# EAGLE design main (EAGLE 5.11)
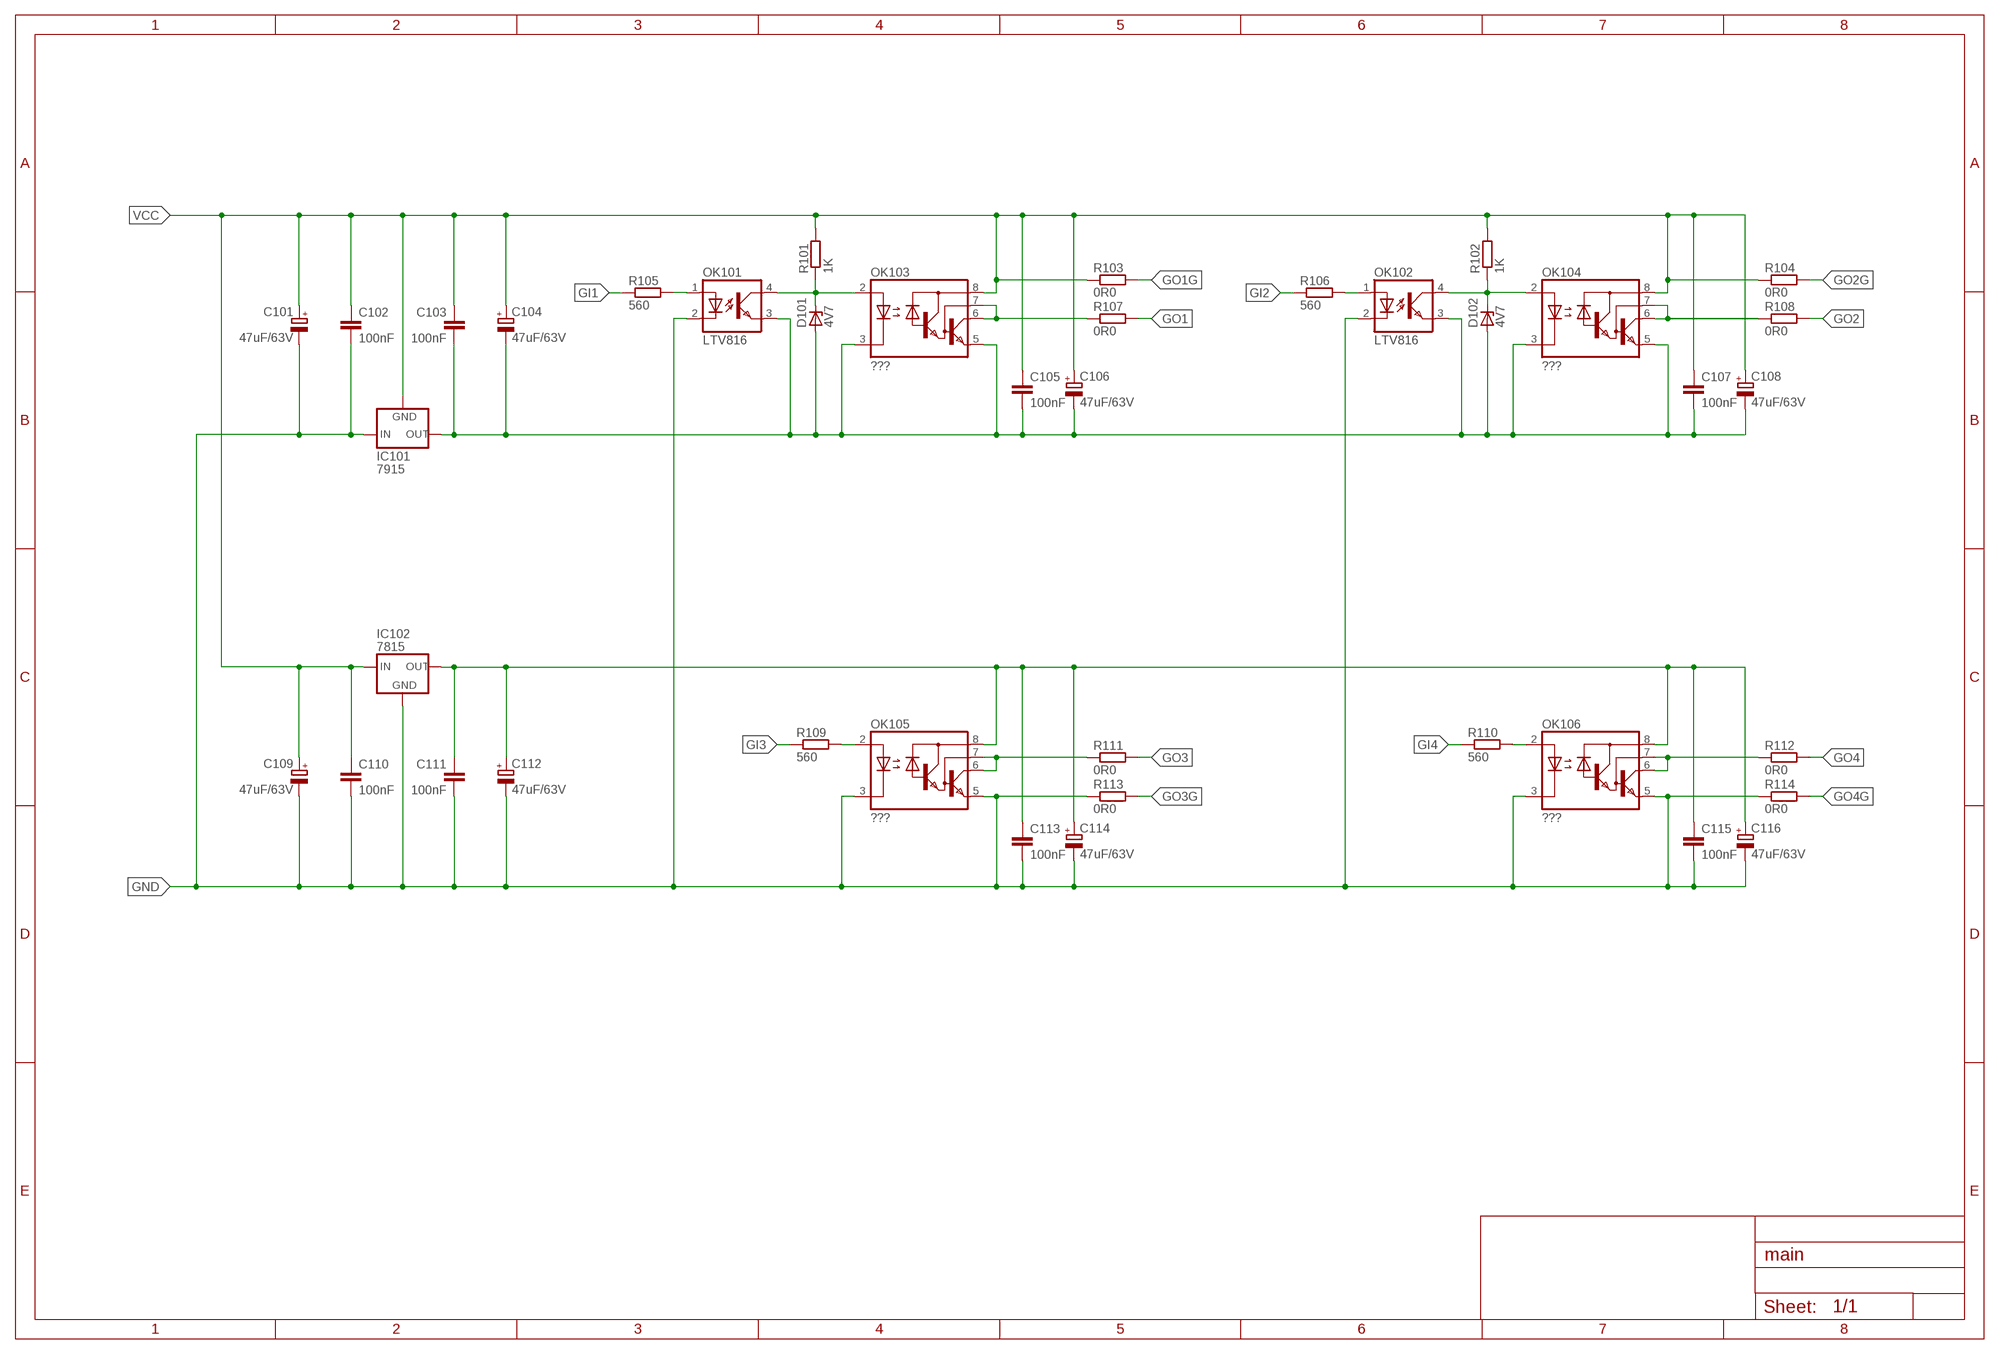
[diagram p0: schematic, sheet 1]

## Parts
C101  47uF/63V  CPOL-EUE2.5-5  [E2,5-5]
C102  100nF  C-EU050-025X075  [C050-025X075]
C103  100nF  C-EU050-025X075  [C050-025X075]
C104  47uF/63V  CPOL-EUE2.5-5  [E2,5-5]
C105  100nF  C-EU050-025X075  [C050-025X075]
C106  47uF/63V  CPOL-EUE2.5-5  [E2,5-5]
C107  100nF  C-EU050-025X075  [C050-025X075]
C108  47uF/63V  CPOL-EUE2.5-5  [E2,5-5]
C109  47uF/63V  CPOL-EUE2.5-5  [E2,5-5]
C110  100nF  C-EU050-025X075  [C050-025X075]
C111  100nF  C-EU050-025X075  [C050-025X075]
C112  47uF/63V  CPOL-EUE2.5-5  [E2,5-5]
C113  100nF  C-EU050-025X075  [C050-025X075]
C114  47uF/63V  CPOL-EUE2.5-5  [E2,5-5]
C115  100nF  C-EU050-025X075  [C050-025X075]
C116  47uF/63V  CPOL-EUE2.5-5  [E2,5-5]
D101  4V7  ZENER-DIODEZD-2.5  [ZDIO-2.5]
D102  4V7  ZENER-DIODEZD-2.5  [ZDIO-2.5]
IC101  7915  79XXS  [79XXS]
IC102  7815  78XXS  [78XXS]
OK101  LTV816  [DIL04]
OK102  LTV816  [DIL04]
OK103  ???  6N138  [DIL08]
OK104  ???  6N138  [DIL08]
OK105  ???  6N138  [DIL08]
OK106  ???  6N138  [DIL08]
R101  1K  R-EU_0207/7  [0207/7]
R102  1K  R-EU_0207/7  [0207/7]
R103  0R0  R-EU_0207/7  [0207/7]
R104  0R0  R-EU_0207/7  [0207/7]
R105  560  R-EU_0207/7  [0207/7]
R106  560  R-EU_0207/7  [0207/7]
R107  0R0  R-EU_0207/7  [0207/7]
R108  0R0  R-EU_0207/7  [0207/7]
R109  560  R-EU_0207/7  [0207/7]
R110  560  R-EU_0207/7  [0207/7]
R111  0R0  R-EU_0207/7  [0207/7]
R112  0R0  R-EU_0207/7  [0207/7]
R113  0R0  R-EU_0207/7  [0207/7]
R114  0R0  R-EU_0207/7  [0207/7]

## Nets
GI1: R105.1
GI2: R106.1
GI3: R109.1
GI4: R110.1
GND: C101.- C102.2 C109.- C110.2 C111.2 C112.- C113.2 C114.- C115.2 C116.- IC101.IN IC102.GND OK101.2(C) OK102.2(C) OK105.3(C) OK105.5(GND) OK106.3(C) OK106.5(GND) R113.1 R114.1
GO1: R107.2
GO1G: R103.2
GO2: R108.2
GO2G: R104.2
GO3: R111.2
GO3G: R113.2
GO4: R112.2
GO4G: R114.2
N$1: OK105.6(VO) OK105.7(VB) R111.1
N$2: OK105.2(A) R109.2
N$4: C111.1 C112.+ C113.1 C114.+ C115.1 C116.+ IC102.OUT OK105.8(VCC) OK106.8(VCC)
N$5: D101.C OK101.4(COL) OK103.2(A) R101.1
N$6: C103.2 C104.- C105.2 C106.- C107.2 C108.- D101.A D102.A IC101.OUT OK101.3(EMIT) OK102.3(EMIT) OK103.3(C) OK103.5(GND) OK104.3(C) OK104.5(GND)
N$8: OK104.6(VO) OK104.7(VB) R108.1
N$10: OK106.2(A) R110.2
N$11: OK101.1(A) R105.2
N$12: OK102.1(A) R106.2
N$13: OK106.6(VO) OK106.7(VB) R112.1
N$15: D102.C OK102.4(COL) OK104.2(A) R102.1
N$17: OK103.6(VO) OK103.7(VB) R107.1
VCC: C101.+ C102.1 C103.1 C104.+ C105.1 C106.+ C107.1 C108.+ C109.+ C110.1 IC101.GND IC102.IN OK103.8(VCC) OK104.8(VCC) R101.2 R102.2 R103.1 R104.1

## Library data of the parts
C101 C104 C106 C108 C109 C112 C114 C116 = rcl:CPOL-EU: POLARIZED CAPACITOR, European symbol
C102 C103 C105 C107 C110 C111 C113 C115 = rcl:C-EU: CAPACITOR, European symbol
D101 D102 = diode:ZENER-DIODE: Z-Diode
IC101 = v-reg:79XXS: VOLTAGE REGULATOR
IC102 = v-reg:78XXS: VOLTAGE REGULATOR
OK101 OK102 = optocoupler:LTV816: OPTO COUPLER Source: LITEON, LTV816.pdf; OC_FARNELL: unknown; OC_NEWARK: unknown
OK103-OK106 = optocoupler:6N138: MOTOROLA OPTO COUPLER; MF: VISHAY/TELEFUNKEN; MPN: 6N138; OC_FARNELL: 9860150; OC_NEWARK: 35K5294
R101-R114 = rcl:R-EU_: RESISTOR, European symbol

## Board
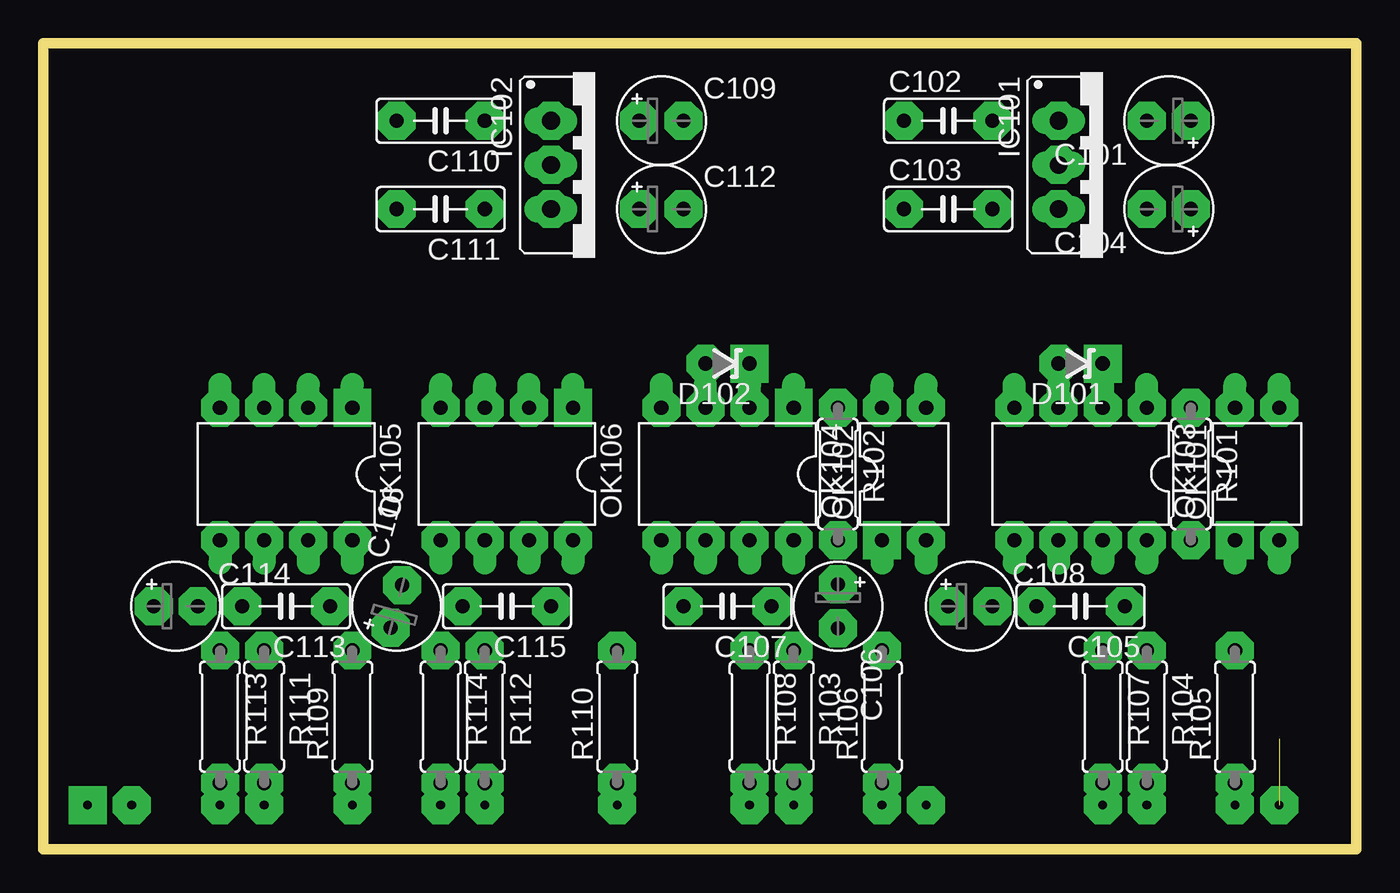
[diagram p1: board, top side]
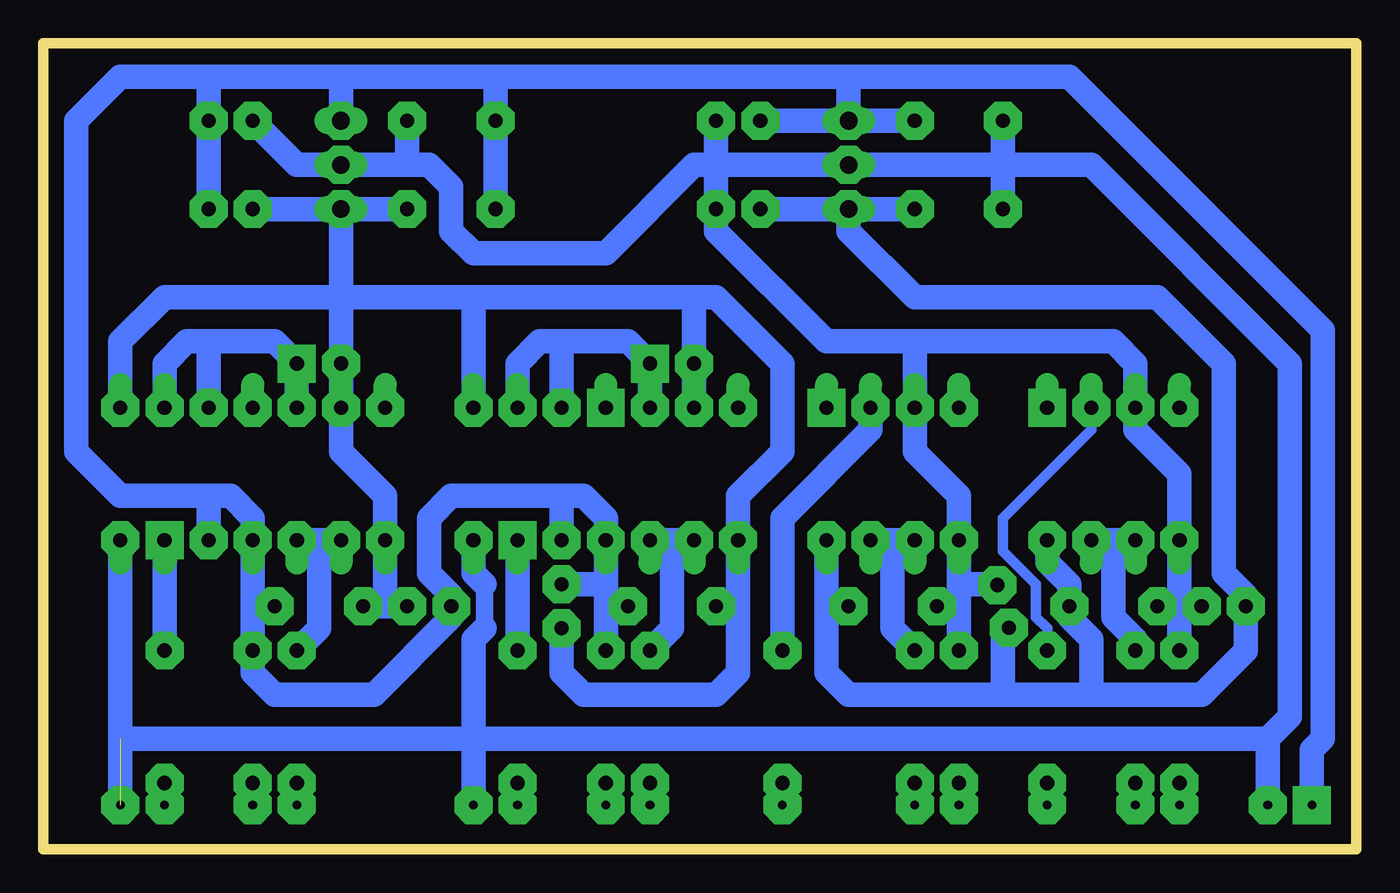
[diagram p2: board, bottom side, seen from below]

Size 75.55 x 46.35 mm. Coordinates in mm from the lower left corner, seen from the top.
Outline: 0,0 75.55,0 75.55,46.35 0,46.35 0,0
Copper layers (1*16): Top 0.035mm / dielectric 1.5mm / Bottom 0.035mm
Design rules "default": minimum track width 10mil, minimum drill 24mil, track to track 8mil, track to pad 8mil, pad to pad 8mil, via to via 8mil, smd to smd 8mil, copper to edge 40mil, drill to drill 8mil, minimum pad ring 10mil, minimum via ring 8mil, stop-mask expansion 4mil, vias tented up to drill 0mil, thermal gap 10mil

### Footprints (pad centres in the part's own frame; a part is rotated, then mirrored left to right if it is on the bottom)
E2,5-5 = drill 0.813 pad 1.6 round: + -1.27,0 | drill 0.813 pad 1.6 octagon: - 1.27,0
C050-025X075 = drill 0.813 octagon: 1 -2.54,0; 2 2.54,0
ZDIO-2.5 = drill 0.813 octagon: A 1.27,0; C -1.27,0
79XXS = drill 1.016 long: GND -2.54,-2.54; IN 0,-2.54; OUT 2.54,-2.54
78XXS = drill 1.016 long: GND 0,-2.54; IN -2.54,-2.54; OUT 2.54,-2.54
DIL04 = drill 0.813 offset: 1 -1.27,-3.81; 2 1.27,-3.81; 3 1.27,3.81; 4 -1.27,3.81
DIL08 = drill 0.813 offset: 1 -3.81,-3.81; 2 -1.27,-3.81; 3 1.27,-3.81; 4 3.81,-3.81; 5 3.81,3.81; 6 1.27,3.81; 7 -1.27,3.81; 8 -3.81,3.81
0207/7 = drill 0.813 octagon: 1 -3.81,0; 2 3.81,0

### Placement (x,y rotation side)
C101  64.77,41.91 180 top
C102  52.07,41.91 0 top
C103  52.07,36.83 0 top
C104  64.77,36.83 180 top
C105  59.69,13.97 180 top
C106  45.72,13.97 270 top
C107  39.37,13.97 180 top
C108  53.34,13.97 0 top
C109  35.56,41.91 0 top
C110  22.86,41.91 180 top
C111  22.86,36.83 180 top
C112  35.56,36.83 0 top
C113  13.97,13.97 180 top
C114  7.62,13.97 0 top
C115  26.67,13.97 180 top
C116  20.32,13.97 75 top
D101  59.69,27.94 180 top
D102  39.37,27.94 180 top
IC101  60.96,39.37 270 top
IC102  31.75,39.37 270 top
OK101  69.85,21.59 0 top
OK102  49.53,21.59 0 top
OK103  59.69,21.59 180 top
OK104  39.37,21.59 180 top
OK105  13.97,21.59 180 top
OK106  26.67,21.59 180 top
R101  66.04,21.59 270 top
R102  45.72,21.59 270 top
R103  43.18,7.62 270 top
R104  63.5,7.62 270 top
R105  68.58,7.62 90 top
R106  48.26,7.62 90 top
R107  60.96,7.62 270 top
R108  40.64,7.62 270 top
R109  17.78,7.62 90 top
R110  33.02,7.62 90 top
R111  12.7,7.62 270 top
R112  25.4,7.62 270 top
R113  10.16,7.62 270 top
R114  22.86,7.62 270 top

### Tracks (layer width: path | path; a pad name or v marks a point on that pad's centre or on a via)
GI1  (via drill 0.5 pad 2.18)
  Bottom 1.422: R105.1 v68.58,2.54
  other vias: 68.58,3.81
GI2  (via drill 0.5 pad 2.18)
  Bottom 1.422: R106.1 v48.26,2.54
  other vias: 48.26,3.81
GI3  (via drill 0.5 pad 2.18)
  Bottom 1.422: R109.1 v17.78,2.54
  other vias: 17.78,3.81
GI4  (via drill 0.5 pad 2.18)
  Bottom 1.422: R110.1 v33.02,2.54
  other vias: 33.02,3.81
GND  (via drill 0.5 pad 2.18)  (1 unrouted)
  Bottom 0.61: 10.16,13.97 C114.-
  Bottom 1.016: 50.16,12.7 50.16,15.24
  Bottom 1.422: C101.- 60.96,39.37 IC101.IN 54.61,39.37 | 36.83,39.37 C112.- 36.83,35.56 30.48,29.21 25.4,29.21 | 36.83,39.37 IC102.GND 20.32,39.37 | 20.32,39.37 C110.2 | 20.32,39.37 C111.2 | 36.83,39.37 C109.- | 36.83,39.37 38.1,39.37 43.18,34.29 50.8,34.29 52.07,35.56 52.07,38.1 53.34,39.37 54.61,39.37 | 22.86,15.24 OK106.5 22.86,20.32 25.4,22.86 OK106.3 25.4,29.21 | 22.86,15.24 22.86,13.97 | 22.86,13.97 C115.2 | 10.16,13.97 OK105.5 10.16,21.59 12.7,24.13 OK105.3 12.7,27.94 13.97,29.21 25.4,29.21 | 50.8,6.35 71.12,6.35 | 10.16,13.97 C113.2 | 10.16,13.97 R113.1 | 22.86,13.97 R114.1 | 54.61,39.37 C102.2 | 50.8,6.35 50.8,12.06 50.16,12.7 | 50.16,15.24 50.8,15.88 OK102.2 | 5.08,6.35 50.8,6.35 | 5.08,6.35 3.81,7.62 3.81,27.94 15.24,39.37 20.32,39.37 | v5.08,2.54 5.08,6.35 | v71.12,2.54 OK101.2 | 50.8,6.35 v50.8,2.54 | 22.86,15.24 20.95,15.24 C116.-
  other vias: 10.16,17.78 22.86,17.78 50.8,17.78 71.12,17.78 25.4,25.4 12.7,25.4 24.13,13.97 11.43,13.97 10.16,11.43 22.86,11.43 20.32,36.83 20.32,41.91 29.21,39.37 36.83,36.83 36.83,41.91 58.42,39.37 63.5,41.91 54.61,41.91 20.65,15.2 8.89,13.97
GO1  (via drill 0.5 pad 2.18)
  Bottom 1.422: R107.2 v60.96,2.54
  other vias: 60.96,3.81
GO1G  (via drill 0.5 pad 2.18)
  Bottom 1.422: R103.2 v43.18,2.54
  other vias: 43.18,3.81
GO2  (via drill 0.5 pad 2.18)
  Bottom 1.422: R108.2 v40.64,2.54
  other vias: 40.64,3.81
GO2G  (via drill 0.5 pad 2.18)
  Bottom 1.422: R104.2 v63.5,2.54
  other vias: 63.5,3.81
GO3  (via drill 0.5 pad 2.18)
  Bottom 1.422: R111.2 v12.7,2.54
  other vias: 12.7,3.81
GO3G  (via drill 0.5 pad 2.18)
  Bottom 1.422: R113.2 v10.16,2.54
  other vias: 10.16,3.81
GO4  (via drill 0.5 pad 2.18)
  Bottom 1.422: R112.2 v25.4,2.54
  other vias: 25.4,3.81
GO4G  (via drill 0.5 pad 2.18)
  Bottom 1.422: R114.2 v22.86,2.54
  other vias: 22.86,3.81
N$1  (via drill 0.5 pad 2.18)
  Bottom 1.422: 13.97,17.78 OK105.7 | 13.97,17.78 OK105.6 | R111.1 12.7,12.06 13.97,13.34 13.97,17.78
  other vias: 12.7,17.78 15.24,17.78 12.7,11.43
N$2  (via drill 0.5 pad 2.18)
  Bottom 0.61: R109.2 17.78,12.7 18.41,13.34 18.41,15.24 20.32,17.14 20.32,19.05 15.24,24.13 OK105.2
  other vias: 15.24,25.4 17.78,11.43
N$4  (via drill 0.5 pad 2.18)
  Bottom 0.61: C116.+ 19.99,11.76 20.32,11.43
  Bottom 1.422: IC102.OUT C112.+ | IC102.OUT C111.1 | 30.48,13.97 OK106.8 | 30.48,13.97 30.48,10.16 29.21,8.89 20.32,8.89 | 30.48,13.97 C115.1 | 15.24,8.89 8.89,8.89 6.35,11.43 C114.+ 6.35,14.61 7.62,15.88 7.62,27.94 11.43,31.75 25.4,31.75 29.21,35.56 IC102.OUT | 15.24,8.89 20.32,8.89 | 20.32,8.89 20.32,11.43 20.32,12.41 C116.+ | OK105.8 17.78,16.51 16.51,15.24 C113.1 16.51,13.34 15.24,12.06 15.24,8.89
  other vias: 17.78,17.78 30.48,17.78 29.21,13.97 16.51,13.97 25.4,36.83 29.21,36.83 34.29,36.83 19.99,12.74 6.35,13.97
N$5  (via drill 0.5 pad 2.18)
  Bottom 1.422: OK103.2 D101.C 62.23,29.21 66.04,29.21 | 66.04,29.21 67.31,29.21 68.58,27.94 OK101.4 | 66.04,29.21 R101.1
  other vias: 68.58,25.4 66.04,25.4 60.96,25.4 60.96,27.94
N$6  (via drill 0.5 pad 2.18)
  Bottom 1.422: IC101.OUT C104.- | IC101.OUT C103.2 | 35.56,13.97 C107.2 | 35.56,13.97 OK104.5 35.56,20.32 33.02,22.86 33.02,27.94 36.83,31.75 38.1,31.75 | C105.2 C108.- 55.88,13.97 OK103.5 55.88,20.32 58.42,22.86 OK103.3 D101.A 58.42,31.75 | OK104.3 D102.A 38.1,31.75 | 38.1,31.75 50.8,31.75 | 50.8,31.75 58.42,31.75 | 58.42,31.75 68.58,31.75 71.12,29.21 OK101.3 | 50.8,31.75 OK102.3 | 58.42,31.75 IC101.OUT | 35.56,13.97 35.56,10.16 36.83,8.89 44.45,8.89 45.72,10.16 C106.-
  other vias: 35.56,17.78 55.88,17.78 71.12,25.4 57.15,13.97 50.8,25.4 38.1,25.4 38.1,27.94 58.42,27.94 58.42,25.4 36.83,13.97 58.42,36.83 63.5,36.83 54.61,36.83 45.72,12.7 54.61,13.97
N$8  (via drill 0.5 pad 2.18)
  Bottom 1.422: OK104.7 OK104.6 39.37,17.78 39.37,12.7 R108.1
  other vias: 38.1,17.78 40.64,11.43 40.64,17.78
N$10  (via drill 0.5 pad 2.18)
  Bottom 1.422: OK106.2 27.94,24.13 33.02,19.05 R110.2
  other vias: 33.02,11.43
N$11  (via drill 0.5 pad 2.18)
  Bottom 1.422: R105.2 OK101.1
  other vias: 68.58,17.78 68.58,11.43
N$12  (via drill 0.5 pad 2.18)
  Bottom 1.422: R106.2 OK102.1
  other vias: 48.26,17.78 48.26,11.43
N$13  (via drill 0.5 pad 2.18)
  Bottom 1.422: R112.1 26.67,12.7 26.67,17.78 OK106.7 OK106.6
  other vias: 25.4,17.78 27.94,17.78 25.4,11.43
N$15  (via drill 0.5 pad 2.18)
  Bottom 1.422: OK104.2 D102.C 41.91,29.21 45.72,29.21 | 45.72,29.21 46.99,29.21 48.26,27.94 OK102.4 | 45.72,29.21 R102.1
  other vias: 45.72,25.4 48.26,25.4 40.64,25.4 40.64,27.94
N$17  (via drill 0.5 pad 2.18)
  Bottom 1.422: R107.1 59.69,12.7 59.69,17.78 OK103.7 OK103.6
  other vias: 58.42,17.78 60.96,17.78 60.96,11.43
N$27  (via drill 0.5 pad 2.18)
  other vias: 27.94,25.4
N$28  (via drill 0.5 pad 2.18)
  other vias: 10.16,25.4
N$29  (via drill 0.5 pad 2.18)
  other vias: 17.78,25.4
N$30  (via drill 0.5 pad 2.18)
  other vias: 30.48,25.4
N$31  (via drill 0.5 pad 2.18)
  other vias: 22.86,25.4
N$32  (via drill 0.5 pad 2.18)
  other vias: 35.56,25.4
N$33  (via drill 0.5 pad 2.18)
  other vias: 43.18,25.4
N$34  (via drill 0.5 pad 2.18)
  other vias: 55.88,25.4
N$35  (via drill 0.5 pad 2.18)
  other vias: 63.5,25.4
VCC  (via drill 0.5 pad 2.18)
  Bottom 1.422: C103.1 C102.1 49.53,44.45 | 49.53,44.45 58.42,44.45 | C104.+ C101.+ 66.04,44.45 | 58.42,44.45 IC101.GND | IC102.IN C110.1 | 43.18,15.24 R103.1 43.18,13.97 C107.1 | IC102.IN C109.+ | 29.21,44.45 IC102.IN | 45.72,20.32 44.45,20.32 43.18,19.05 OK104.8 43.18,15.24 | 45.72,20.32 52.07,20.32 53.34,19.05 53.34,15.88 52.07,14.61 C108.+ 52.07,13.34 56.52,8.89 62.23,8.89 63.5,10.16 R104.1 63.5,13.97 | 66.04,20.32 R101.2 | 45.72,20.32 R102.2 | 63.5,13.97 OK103.8 63.5,19.05 64.77,20.32 66.04,20.32 | 63.5,13.97 C105.1 | 29.21,44.45 49.53,44.45 | 66.04,20.32 71.12,20.32 73.66,22.86 73.66,41.91 71.12,44.45 66.04,44.45 | 29.21,44.45 16.51,44.45 1.91,29.84 1.91,6.35 2.54,5.71 v2.54,2.54 | 58.42,44.45 66.04,44.45 | 43.18,15.24 C106.+
  other vias: 43.18,17.78 45.72,17.78 63.5,17.78 41.91,13.97 62.23,13.97 43.18,11.43 66.04,17.78 63.5,11.43 25.4,41.91 29.21,41.91 34.29,41.91 49.53,36.83 49.53,41.91 58.42,41.91 66.04,36.83 66.04,41.91 45.72,15.24 52.07,13.97